# EAGLE design HMS_Olfactometer_v2.1 (EAGLE 9.1.1)

## Sheet 1 of 2
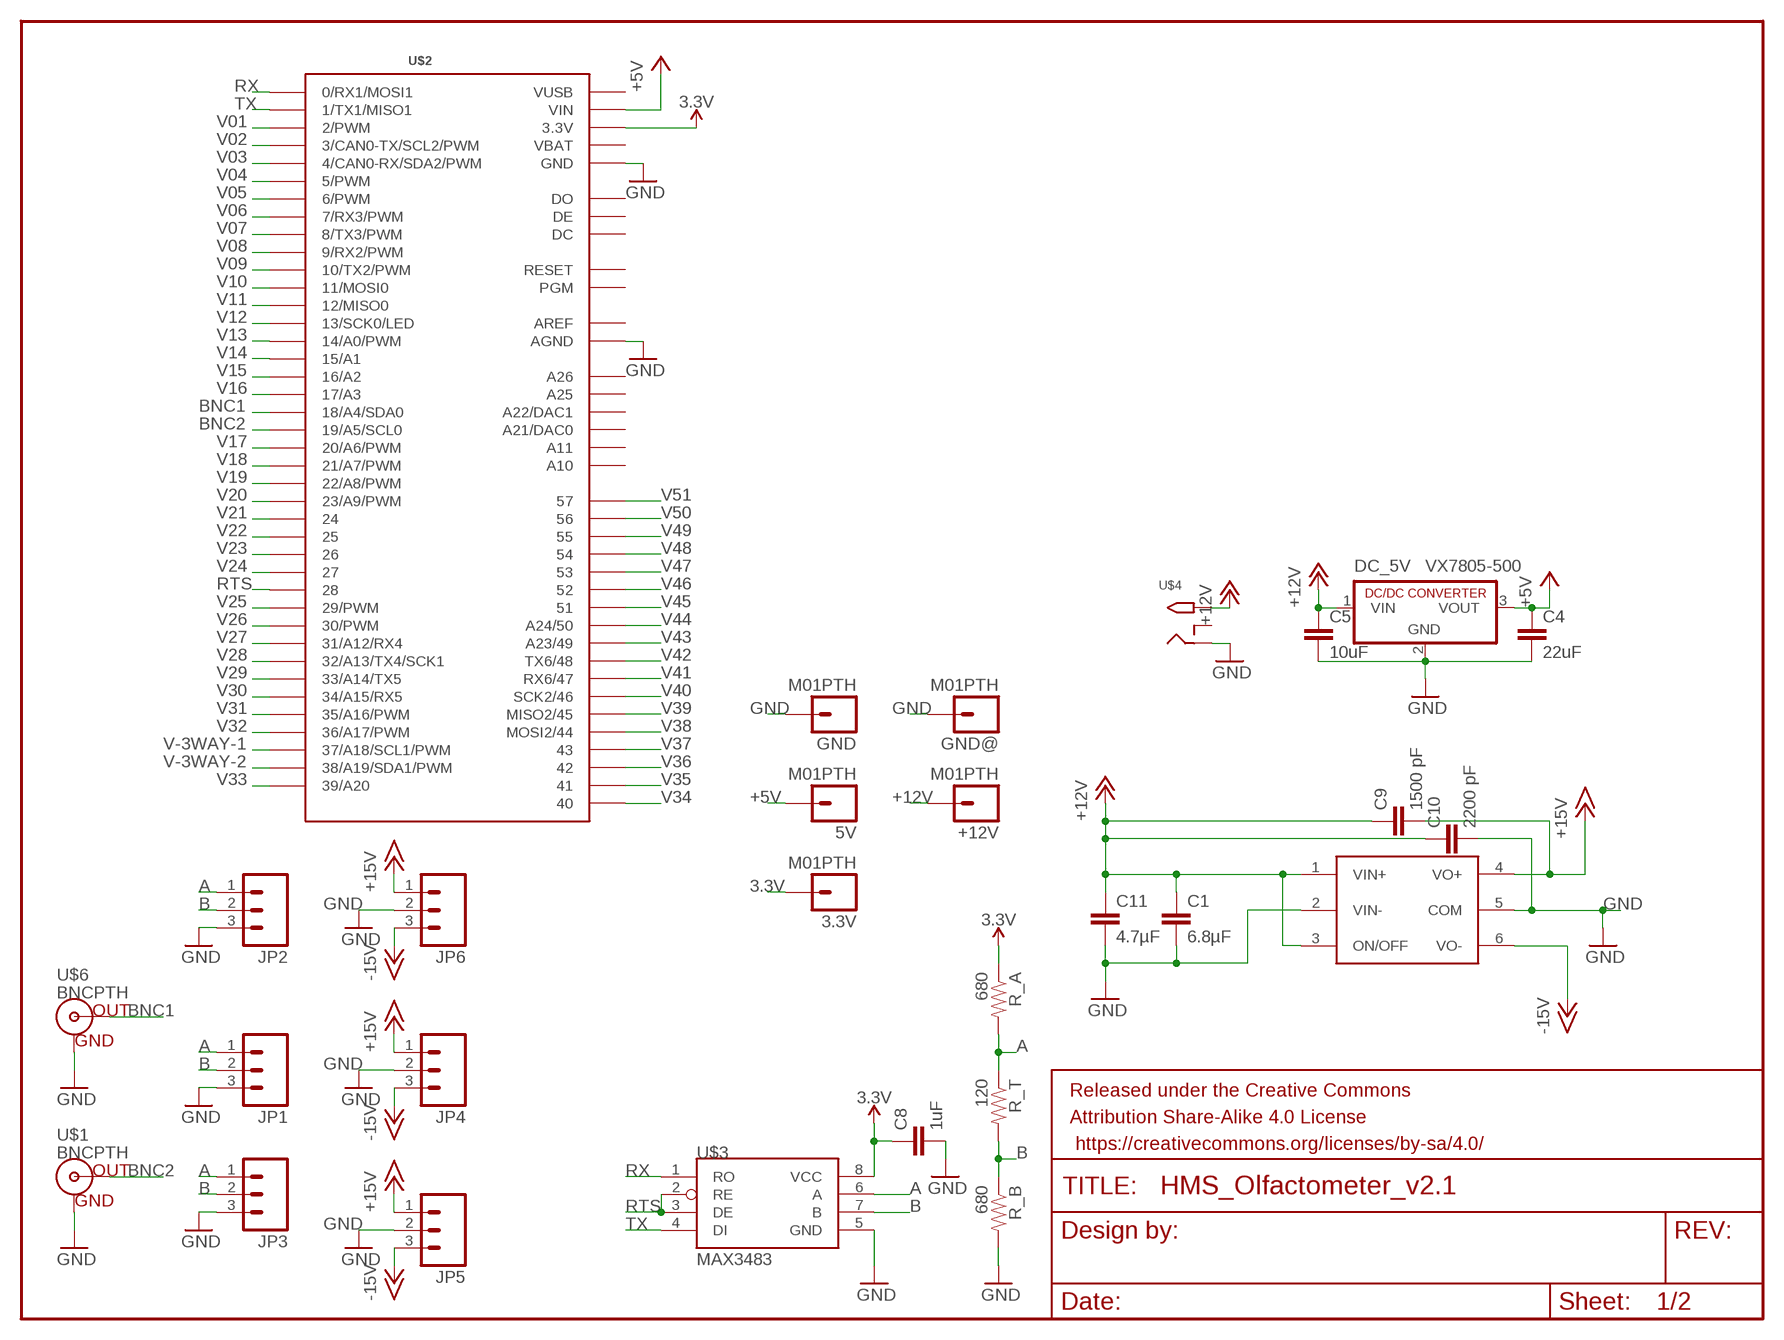
[diagram p0: schematic, sheet 1]

### Parts
3.3V  M01PTH  [1X01]
5V  M01PTH  [1X01]
+12V  M01PTH  [1X01]
C1  6.8µF  C-EUC1812  [C1812]
C4  22uF  10UF-6.3V-20%(1206)  [1206]
C5  10uF  CAP1206  [1206]
C8  1uF  CAP1206  [1206]
C9  1500 pF  C-EUC1206  [C1206]
C10  2200 pF  C-EUC1206  [C1206]
C11  4.7µF  C-EUC1812  [C1812]
DC_5V  VX7805-500  R-78C12-1.0  [SIP3]
DC_+/-15V  XPPOWER_+/-15V_60W_DC-DC_SUPPLY  [XPPOWER_60W_JTL60_DC_DC_POWER_SUPPLY]
FRAME1  FRAME-LETTER  [CREATIVE_COMMONS]
GND  M01PTH  [1X01]
GND@  M01PTH  [1X01]
JP1  M03POLAR  [MOLEX-1X3]
JP2  M03POLAR  [MOLEX-1X3]
JP3  M03POLAR  [MOLEX-1X3]
JP4  M03SCREW  [SCREWTERMINAL-3.5MM-3]
JP5  M03SCREW  [SCREWTERMINAL-3.5MM-3]
JP6  M03SCREW  [SCREWTERMINAL-3.5MM-3]
R_A  680  RESISTORPTH-1/2W  [AXIAL-0.5]
R_B  680  RESISTORPTH-1/2W  [AXIAL-0.5]
R_T  120  RESISTORPTH-1/2W  [AXIAL-0.5]
U$1  BNCPTH  [BNC]
U$2  TEENSY_3.5_ALL_PINS&PADS  [TEENSY_3.5_ALL_PINS&PADS]
U$3  MAX3483  MAX485DIL  [DIL08]
U$4  2.1MMJACKTHM  [PJ-102A]
U$6  BNCPTH  [BNC]

### Nets
3.3V [power]: 3.3V.1 C8.1 R_A.P$1 U$2.3.3V U$2.3.3V2(3.3V) U$2.3.3V3(3.3V) U$2.3.3V4(3.3V) U$3.8(VCC)
+5V [power]: 5V.1 C4.1 DC_5V.3(VOUT) U$2.VIN
+12V [power]: +12V.1 C1.1 C5.1 C9.1 C10.1 C11.1 DC_5V.1(VIN) DC_+/-15V.1(VIN+) DC_+/-15V.3(ON/OFF) U$4.TIP ; also sheet 2
+15V: C9.2 DC_+/-15V.4(VO+) JP4.1 JP5.1 JP6.1
-15V: DC_+/-15V.6(VO-) JP4.3 JP5.3 JP6.3
A: JP1.1 JP2.1 JP3.1 R_A.P$2 R_T.P$1 U$3.6(A)
B: JP1.2 JP2.2 JP3.2 R_B.P$1 R_T.P$2 U$3.7(B)
BNC1: U$2.18/A4(18/A4/SDA0) U$6.S(OUT)
BNC2: U$1.S(OUT) U$2.19/A5(19/A5/SCL0)
GND: C1.2 C4.2 C5.2 C8.2 C10.2 C11.2 DC_5V.2(GND) DC_+/-15V.2(VIN-) DC_+/-15V.5(COM) GND.1 GND@.1 JP1.3 JP2.3 JP3.3 JP4.2 JP5.2 JP6.2 R_B.P$2 U$1.GND U$2.AGND U$2.GND U$2.GND1(GND) U$2.GND2(GND) U$2.GND3(GND) U$2.GND4(GND) U$2.GND5(GND) U$2.GND6(GND) U$3.5(GND) U$4.RING U$6.GND ; also sheet 2
RTS: U$2.28 U$3.2(RE) U$3.3(DE)
RX: U$2.0(0/RX1/MOSI1) U$3.1(RO)
TX: U$2.1(1/TX1/MISO1) U$3.4(DI)
V01: U$2.2(2/PWM) ; also sheet 2
V02: U$2.3(3/CAN0-TX/SCL2/PWM) ; also sheet 2
V03: U$2.4(4/CAN0-RX/SDA2/PWM) ; also sheet 2
V04: U$2.5(5/PWM) ; also sheet 2
V05: U$2.6(6/PWM) ; also sheet 2
V06: U$2.7(7/RX3/PWM) ; also sheet 2
V07: U$2.8(8/TX3/PWM) ; also sheet 2
V08: U$2.9(9/RX2/PWM) ; also sheet 2
V09: U$2.10(10/TX2/PWM) ; also sheet 2
V10: U$2.11(11/MOSI0) ; also sheet 2
V11: U$2.12(12/MISO0) ; also sheet 2
V12: U$2.13(13/SCK0/LED) ; also sheet 2
V13: U$2.14/A0(14/A0/PWM) ; also sheet 2
V14: U$2.15/A1 ; also sheet 2
V15: U$2.16/A2 ; also sheet 2
V16: U$2.17/A3 ; also sheet 2
V17: U$2.20/A6(20/A6/PWM) ; also sheet 2
V18: U$2.21/A7(21/A7/PWM) ; also sheet 2
V19: U$2.22/A8(22/A8/PWM) ; also sheet 2
V20: U$2.23/A9(23/A9/PWM) ; also sheet 2
V21: U$2.24 ; also sheet 2
V22: U$2.25 ; also sheet 2
V23: U$2.26 ; also sheet 2
V24: U$2.27 ; also sheet 2
V25: U$2.29(29/PWM) ; also sheet 2
V26: U$2.30(30/PWM) ; also sheet 2
V27: U$2.31/A12(31/A12/RX4) ; also sheet 2
V28: U$2.32/A13(32/A13/TX4/SCK1) ; also sheet 2
V29: U$2.33/A14(33/A14/TX5) ; also sheet 2
V30: U$2.34/A15(34/A15/RX5) ; also sheet 2
V31: U$2.35/A16(35/A16/PWM) ; also sheet 2
V32: U$2.36/A17(36/A17/PWM) ; also sheet 2
V33: U$2.39/A20 ; also sheet 2
V34: U$2.40 ; also sheet 2
V35: U$2.41 ; also sheet 2
V36: U$2.42 ; also sheet 2
V37: U$2.43 ; also sheet 2
V38: U$2.44(MOSI2/44) ; also sheet 2
V39: U$2.45(MISO2/45) ; also sheet 2
V40: U$2.46(SCK2/46) ; also sheet 2
V41: U$2.47(RX6/47) ; also sheet 2
V42: U$2.48(TX6/48) ; also sheet 2
V43: U$2.49(A23/49) ; also sheet 2
V44: U$2.50(A24/50) ; also sheet 2
V45: U$2.51 ; also sheet 2
V46: U$2.52 ; also sheet 2
V47: U$2.53 ; also sheet 2
V48: U$2.54 ; also sheet 2
V49: U$2.55 ; also sheet 2
V50: U$2.56 ; also sheet 2
V51: U$2.57 ; also sheet 2
V-3WAY-1: U$2.37/A18(37/A18/SCL1/PWM) ; also sheet 2
V-3WAY-2: U$2.38/A19(38/A19/SDA1/PWM) ; also sheet 2
Unconnected: U$2.A10 U$2.A11 U$2.A21(A21/DAC0) U$2.A22(A22/DAC1) U$2.A25 U$2.A26 U$2.DC U$2.DE U$2.DO U$2.PGM U$2.RESET U$4.RING_SW

## Sheet 2 of 2
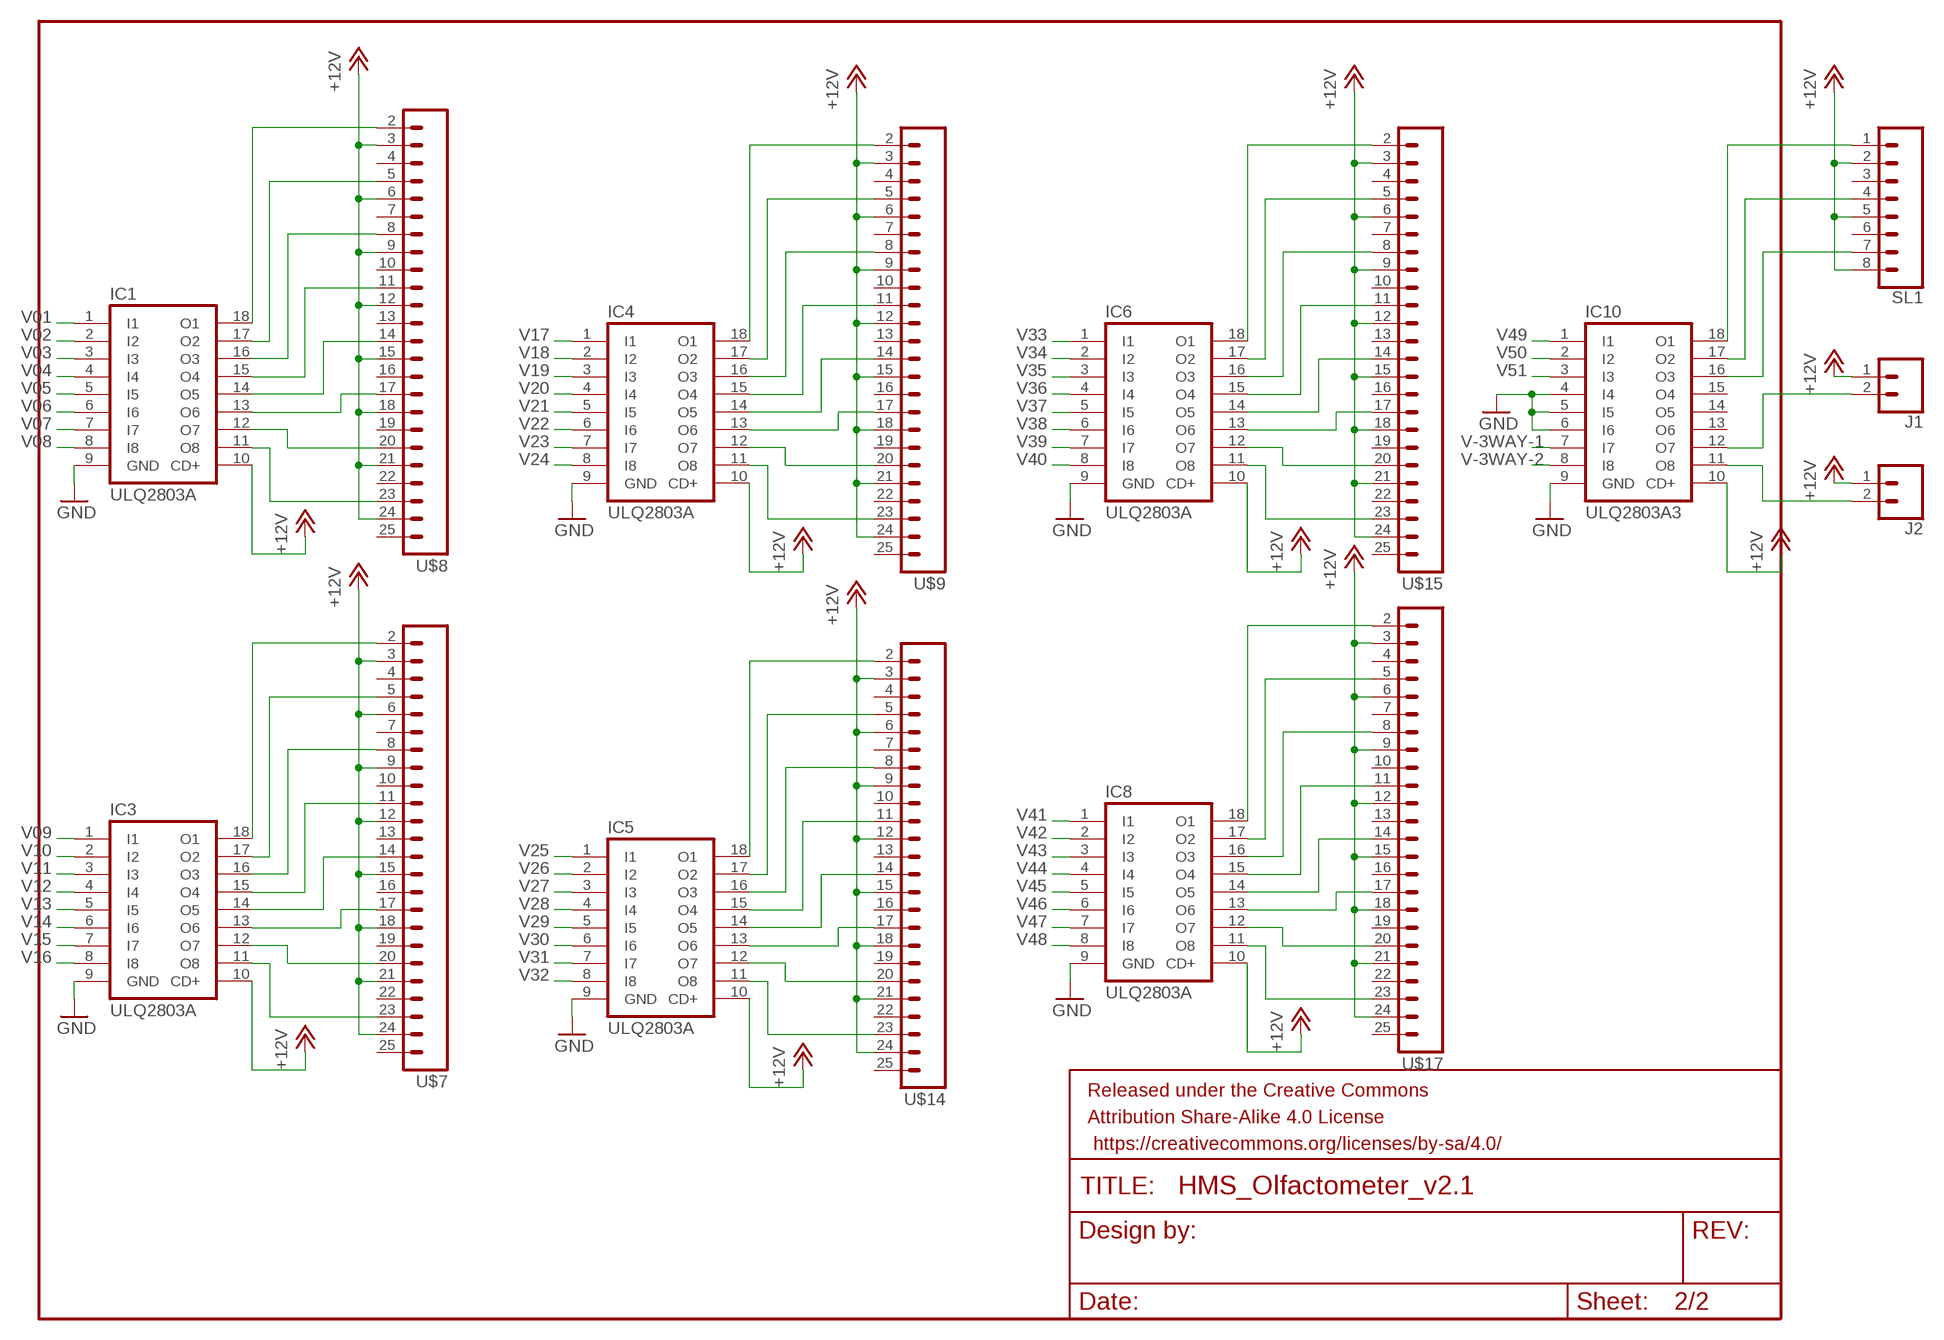
[diagram p1: schematic, sheet 2]

### Parts
FRAME2  FRAME-LETTER  [CREATIVE_COMMONS]
IC1  ULQ2803A  ULN2803A  [DIL18]
IC3  ULQ2803A  ULN2803A  [DIL18]
IC4  ULQ2803A  ULN2803A  [DIL18]
IC5  ULQ2803A  ULN2803A  [DIL18]
IC6  ULQ2803A  ULN2803A  [DIL18]
IC8  ULQ2803A  ULN2803A  [DIL18]
IC10  ULQ2803A3  ULN2803A  [DIL18]
J1  CONN_02  [1X02]
J2  CONN_02  [1X02]
SL1  CONN_08"  [1X08]
U$7  M24  [1X24]
U$8  M24  [1X24]
U$9  M24  [1X24]
U$14  M24  [1X24]
U$15  M24  [1X24]
U$17  M24  [1X24]

### Nets
+12V [power]: IC1.10(CD+) IC3.10(CD+) IC4.10(CD+) IC5.10(CD+) IC6.10(CD+) IC8.10(CD+) IC10.10(CD+) J1.1 J2.1 SL1.2 SL1.5 SL1.8 U$7.3 U$7.6 U$7.9 U$7.12 U$7.15 U$7.18 U$7.21 U$7.24 U$8.3 U$8.6 U$8.9 U$8.12 U$8.15 U$8.18 U$8.21 U$8.24 U$9.3 U$9.6 U$9.9 U$9.12 U$9.15 U$9.18 U$9.21 U$9.24 U$14.3 U$14.6 U$14.9 U$14.12 U$14.15 U$14.18 U$14.21 U$14.24 U$15.3 U$15.6 U$15.9 U$15.12 U$15.15 U$15.18 U$15.21 U$15.24 U$17.3 U$17.6 U$17.9 U$17.12 U$17.15 U$17.18 U$17.21 U$17.24 ; also sheet 1
GND: IC1.9(GND) IC3.9(GND) IC4.9(GND) IC5.9(GND) IC6.9(GND) IC8.9(GND) IC10.4(I4) IC10.5(I5) IC10.6(I6) IC10.9(GND) ; also sheet 1
N$2: IC1.18(O1) U$8.2
N$3: IC1.17(O2) U$8.5
N$4: IC1.16(O3) U$8.8
N$5: IC1.15(O4) U$8.11
N$6: IC1.14(O5) U$8.14
N$7: IC1.13(O6) U$8.17
N$8: IC1.12(O7) U$8.20
N$9: IC1.11(O8) U$8.23
N$17: IC3.11(O8) U$7.23
N$18: IC3.12(O7) U$7.20
N$19: IC3.13(O6) U$7.17
N$20: IC3.14(O5) U$7.14
N$21: IC3.15(O4) U$7.11
N$22: IC3.16(O3) U$7.8
N$23: IC3.17(O2) U$7.5
N$24: IC3.18(O1) U$7.2
N$25: IC4.11(O8) U$9.23
N$26: IC4.12(O7) U$9.20
N$27: IC4.13(O6) U$9.17
N$28: IC4.14(O5) U$9.14
N$29: IC4.15(O4) U$9.11
N$30: IC4.16(O3) U$9.8
N$31: IC4.17(O2) U$9.5
N$32: IC4.18(O1) U$9.2
N$33: IC5.11(O8) U$14.23
N$34: IC5.12(O7) U$14.20
N$35: IC5.13(O6) U$14.17
N$36: IC5.14(O5) U$14.14
N$37: IC5.15(O4) U$14.11
N$38: IC5.16(O3) U$14.8
N$39: IC5.17(O2) U$14.5
N$40: IC5.18(O1) U$14.2
N$51: IC6.11(O8) U$15.23
N$52: IC6.12(O7) U$15.20
N$61: IC6.13(O6) U$15.17
N$63: IC6.14(O5) U$15.14
N$64: IC6.15(O4) U$15.11
N$65: IC6.16(O3) U$15.8
N$66: IC6.17(O2) U$15.5
N$67: IC6.18(O1) U$15.2
N$76: IC8.11(O8) U$17.23
N$77: IC8.12(O7) U$17.20
N$78: IC8.13(O6) U$17.17
N$79: IC8.14(O5) U$17.14
N$80: IC8.15(O4) U$17.11
N$81: IC8.16(O3) U$17.8
N$82: IC8.17(O2) U$17.5
N$83: IC8.18(O1) U$17.2
N$92: IC10.11(O8) J2.2
N$93: IC10.12(O7) J1.2
N$97: IC10.16(O3) SL1.7
N$98: IC10.17(O2) SL1.4
N$99: IC10.18(O1) SL1.1
V01: IC1.1(I1) ; also sheet 1
V02: IC1.2(I2) ; also sheet 1
V03: IC1.3(I3) ; also sheet 1
V04: IC1.4(I4) ; also sheet 1
V05: IC1.5(I5) ; also sheet 1
V06: IC1.6(I6) ; also sheet 1
V07: IC1.7(I7) ; also sheet 1
V08: IC1.8(I8) ; also sheet 1
V09: IC3.1(I1) ; also sheet 1
V10: IC3.2(I2) ; also sheet 1
V11: IC3.3(I3) ; also sheet 1
V12: IC3.4(I4) ; also sheet 1
V13: IC3.5(I5) ; also sheet 1
V14: IC3.6(I6) ; also sheet 1
V15: IC3.7(I7) ; also sheet 1
V16: IC3.8(I8) ; also sheet 1
V17: IC4.1(I1) ; also sheet 1
V18: IC4.2(I2) ; also sheet 1
V19: IC4.3(I3) ; also sheet 1
V20: IC4.4(I4) ; also sheet 1
V21: IC4.5(I5) ; also sheet 1
V22: IC4.6(I6) ; also sheet 1
V23: IC4.7(I7) ; also sheet 1
V24: IC4.8(I8) ; also sheet 1
V25: IC5.1(I1) ; also sheet 1
V26: IC5.2(I2) ; also sheet 1
V27: IC5.3(I3) ; also sheet 1
V28: IC5.4(I4) ; also sheet 1
V29: IC5.5(I5) ; also sheet 1
V30: IC5.6(I6) ; also sheet 1
V31: IC5.7(I7) ; also sheet 1
V32: IC5.8(I8) ; also sheet 1
V33: IC6.1(I1) ; also sheet 1
V34: IC6.2(I2) ; also sheet 1
V35: IC6.3(I3) ; also sheet 1
V36: IC6.4(I4) ; also sheet 1
V37: IC6.5(I5) ; also sheet 1
V38: IC6.6(I6) ; also sheet 1
V39: IC6.7(I7) ; also sheet 1
V40: IC6.8(I8) ; also sheet 1
V41: IC8.1(I1) ; also sheet 1
V42: IC8.2(I2) ; also sheet 1
V43: IC8.3(I3) ; also sheet 1
V44: IC8.4(I4) ; also sheet 1
V45: IC8.5(I5) ; also sheet 1
V46: IC8.6(I6) ; also sheet 1
V47: IC8.7(I7) ; also sheet 1
V48: IC8.8(I8) ; also sheet 1
V49: IC10.1(I1) ; also sheet 1
V50: IC10.2(I2) ; also sheet 1
V51: IC10.3(I3) ; also sheet 1
V-3WAY-1: IC10.7(I7) ; also sheet 1
V-3WAY-2: IC10.8(I8) ; also sheet 1
Unconnected: IC10.13(O6) IC10.14(O5) IC10.15(O4) SL1.3 SL1.6 U$7.4 U$7.7 U$7.10 U$7.13 U$7.16 U$7.19 U$7.22 U$7.25 U$8.4 U$8.7 U$8.10 U$8.13 U$8.16 U$8.19 U$8.22 U$8.25 U$9.4 U$9.7 U$9.10 U$9.13 U$9.16 U$9.19 U$9.22 U$9.25 U$14.4 U$14.7 U$14.10 U$14.13 U$14.16 U$14.19 U$14.22 U$14.25 U$15.4 U$15.7 U$15.10 U$15.13 U$15.16 U$15.19 U$15.22 U$15.25 U$17.4 U$17.7 U$17.10 U$17.13 U$17.16 U$17.19 U$17.22 U$17.25

## Power pins joined to a net without a drawn wire
AREF: U$2.AREF
VBAT: U$2.VBAT
VUSB: U$2.VUSB

## Library data of the parts
3.3V 5V +12V GND GND@ = SparkFun-Connectors:M01: Header 1 Standard 1-pin 0.1" header. Use with straight break away headers (SKU : PRT-00116), right angle break away headers (PRT-00553), swiss pins (PRT-00743), machine pins (PRT-00117), and female headers (PRT-00115).
C1 C9-C11 = rcl:C-EU: CAPACITOR, European symbol; SPICEPREFIX: C
C4 = SparkFun-Capacitors:10UF-6.3V-20%(1206): Ceramic CAP-10057; PROD_ID: CAP-10057; VALUE: 10uF
C5 C8 = SparkFun-Capacitors:CAP: Capacitor Standard 0603 ceramic capacitor, and 0.1" leaded capacitor.
DC_5V = dc-dc-converter:R-78C*-1.0: INNOLINE DC/DC-Converter 1.0 AMP SIP3 Single Output Source: Data sheet <http://www.mikrocontroller.net/attachment/150645/157764-da-01-en-DC_DC_WANDLER_R_78C5_0_1_0.pdf>
DC_+/-15V = ofer-eagle-lib:XPPOWER_+/-15V_60W_DC-DC_SUPPLY
FRAME1 FRAME2 = SparkFun-Aesthetics:FRAME-LETTER: Schematic Frame - Letter Standard 8.5x11 US Letter frame
IC1 IC3-IC6 IC8 IC10 = uln-udn:ULN2803A: DRIVER ARRAY
J1 J2 = SparkFun-Connectors:CONN_02: Multi connection point. Often used as Generic Header-pin footprint for 0.1 inch spaced/style header connections On any of the 0.1 inch spaced packages, you can populate with these: Break Away Headers - Straight <https://www.sparkfun.com/products/116> (PRT-00116) Break Away Male Headers - Right Angle <https://www.sparkfun.com/products/553> (PRT-00553) Female Headers <https://www.sparkfun.com/products/115> (PRT-00115) Break Away Headers - Machine Pin <https://www.sparkfun.com/products/117> (PRT-00117) Break Away Female Headers - Swiss Machine Pin <https://www.sparkfun.com/products/743> (PRT-00743) For SCREWTERMINALS and SPRING TERMINALS visit here: Screw Terimnals on SparkFun.com <https://www.sparkfun.com/search/results?term=Screw+Terminals> (5mm/3.5mm/2.54mm spacing) This device is also useful as a general connection point to wire up your design to another part of your project. Our various solder wires solder well into these plated through hole pads. Hook-Up Wire - Assortment (Stranded, 22 AWG) <https://www.sparkfun.com/products/11375> (PRT-11375) Hook-Up Wire - Assortment (Solid Core, 22 AWG) <https://www.sparkfun.com/products/11367> (PRT-11367) View the entire wire category on our website here <https://www.sparkfun.com/categories/141> Special notes: Molex polarized connector foot print use with: PRT-08233 with associated crimp pins and housings. 2.54_SCREWTERM for use with PRT-10571. 3.5mm Screw Terminal footprints for PRT-08084 5mm Screw Terminal footprints for use with PRT-08432
JP1-JP6 = SparkFun-Connectors:M03: Header 3 Standard 3-pin 0.1" header. Use with straight break away headers (SKU : PRT-00116), right angle break away headers (PRT-00553), swiss pins (PRT-00743), machine pins (PRT-00117), and female headers (PRT-00115). Molex polarized connector foot print use with SKU : PRT-08232 with associated crimp pins and housings.
R_A R_B R_T = SparkFun-Resistors:RESISTOR: Resistor Basic schematic elements and footprints for 0603, 1206, and PTH resistors.
SL1 = SparkFun-Connectors:CONN_08: Multi connection point. Often used as Generic Header-pin footprint for 0.1 inch spaced/style header connections On any of the 0.1 inch spaced packages, you can populate with these: Break Away Headers - Straight <https://www.sparkfun.com/products/116> (PRT-00116) Break Away Male Headers - Right Angle <https://www.sparkfun.com/products/553> (PRT-00553) Female Headers <https://www.sparkfun.com/products/115> (PRT-00115) Break Away Headers - Machine Pin <https://www.sparkfun.com/products/117> (PRT-00117) Break Away Female Headers - Swiss Machine Pin <https://www.sparkfun.com/products/743> (PRT-00743) Arduino Stackable Header - 8 Pin <https://www.sparkfun.com/products/9279> (PRT-09279) For SCREWTERMINALS and SPRING TERMINALS visit here: Screw Terimnals on SparkFun.com <https://www.sparkfun.com/search/results?term=Screw+Terminals> (5mm/3.5mm/2.54mm spacing) This device is also useful as a general connection point to wire up your design to another part of your project. Our various solder wires solder well into these plated through hole pads. Hook-Up Wire - Assortment (Stranded, 22 AWG) <https://www.sparkfun.com/products/11375> (PRT-11375) Hook-Up Wire - Assortment (Solid Core, 22 AWG) <https://www.sparkfun.com/products/11367> (PRT-11367) View the entire wire category on our website here <https://www.sparkfun.com/categories/141> Special notes: Molex polarized connector foot print use with SKU : PRT-08231 with associated crimp pins and housings. 1MM SMD Version SKU: PRT-10208 NOTES ON THE VARIANTS LOCK and LOCK_LONGPADS... This footprint was designed to help hold the alignment of a through-hole component (i.e. 6-pin header) while soldering it into place. You may notice that each hole has been shifted either up or down by 0.005 of an inch from it's more standard position (which is a perfectly straight line). This slight alteration caused the pins (the squares in the middle) to touch the edges of the holes. Because they are alternating, it causes a "brace" to hold the component in place. 0.005 has proven to be the perfect amount of "off-center" position when using our standard breakaway headers. Although looks a little odd when you look at the bare footprint, once you have a header in there, the alteration is very hard to notice. Also,if you push a header all the way into place, it is covered up entirely on the bottom side.; PROD_ID: CONN-08438
U$1 U$6 = SparkFun-Connectors:BNC: BNC Connector, Mouser Part# 5227161
U$2 = Teensy_3_and_LC_Series_Boards_v1.4:TEENSY_3.5_ALL_PINS&PADS: All pins and pads on the Teensy 3.5 exposed. Assumes the use of multiple, unshrouded headers to get access to the pads on the underside of the Teensy These headers should be a 2x5, 2x4, and a 2x3 with a 0.1" hole spacing / pitch.
U$3 = SparkFun-DigitalIC:MAX485: RS-485 transceiver; SPICEPREFIX: X
U$4 = adafruit:2.1MMJACK: 2.1mm x 5.5mm THM DC jack with internal switch. Digikey part #PJ-102A, 4UCON part #05537 2.1mm x 5.5mm SMT DC jack with internal switch. Digikey part #PJ-002A-SMT, 4UCON part #03267 By microbuilder.eu & adafruit.com
U$7-U$9 U$14 U$15 U$17 = SparkFun-Connectors:M24: 1x24 .1" header

## Net classes
0 default: width 0.203 mm, clearance 0.203 mm
1 power: width 0.61 mm, clearance 0.254 mm

## Board
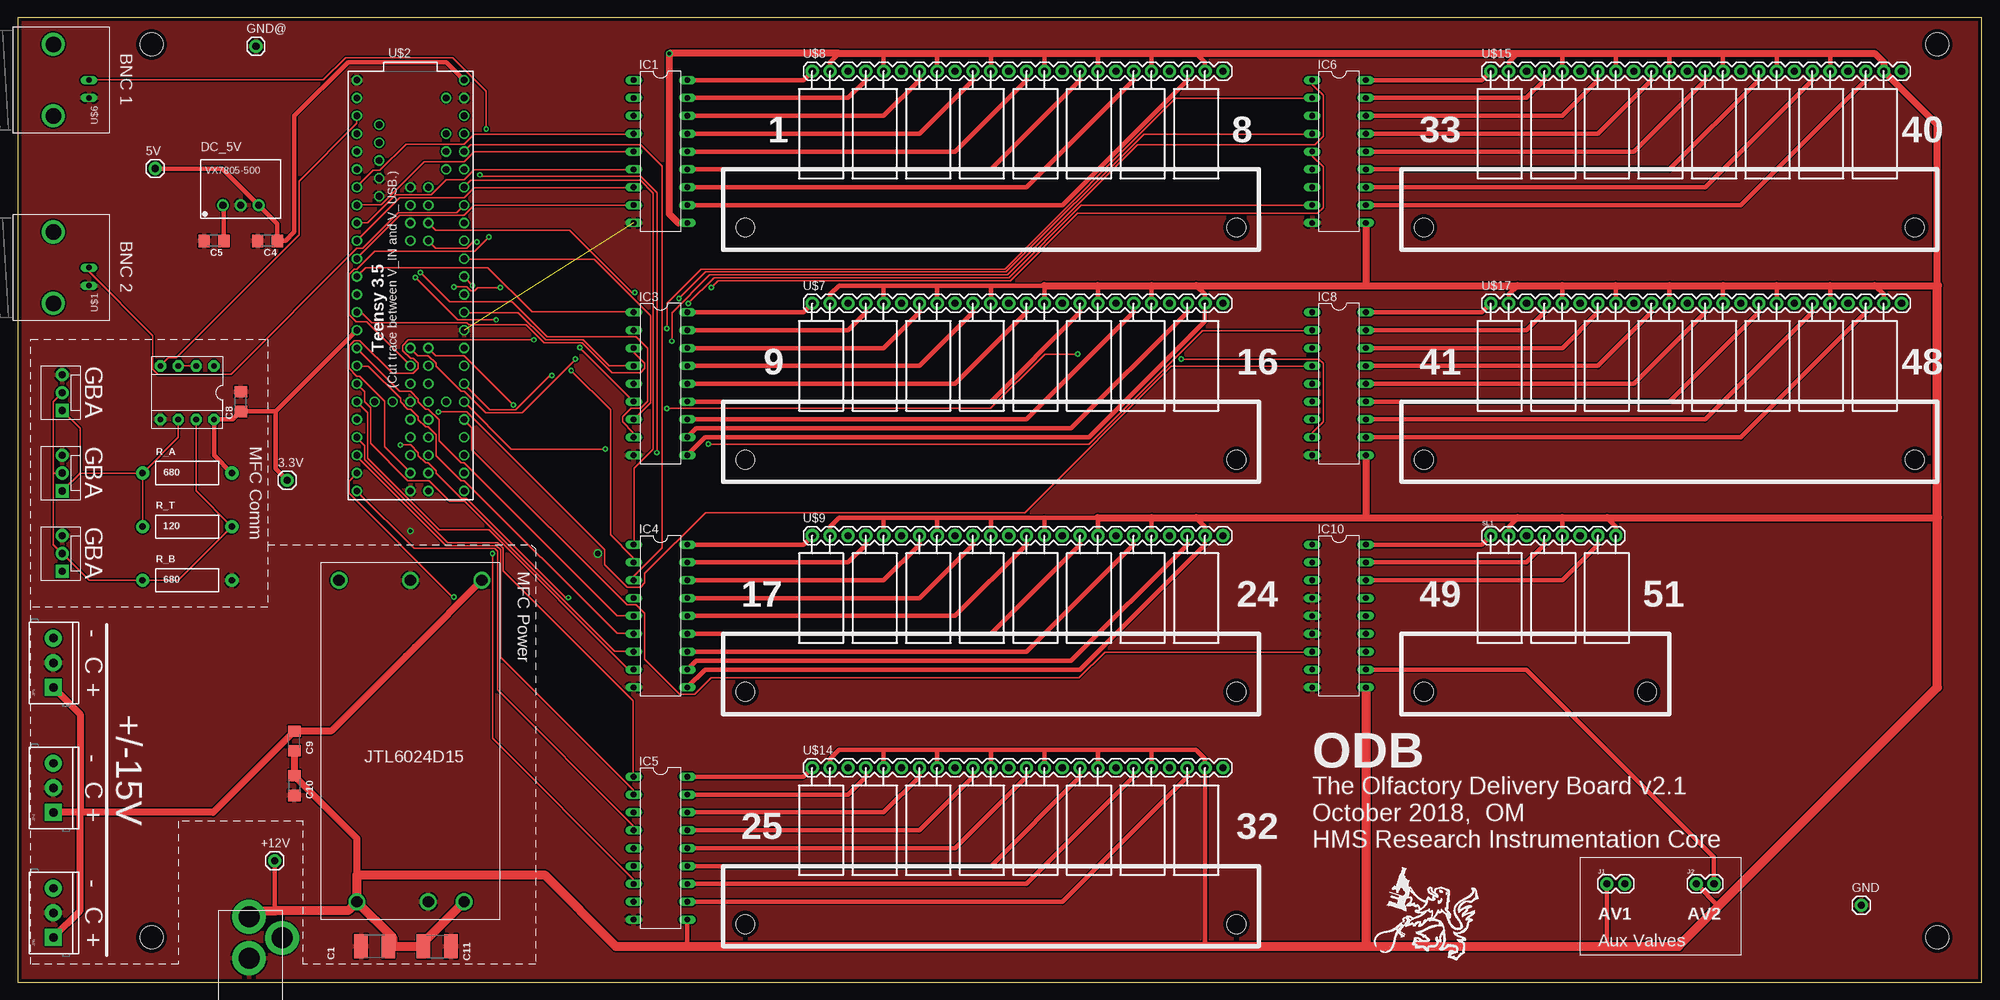
[diagram p2: board, top side]
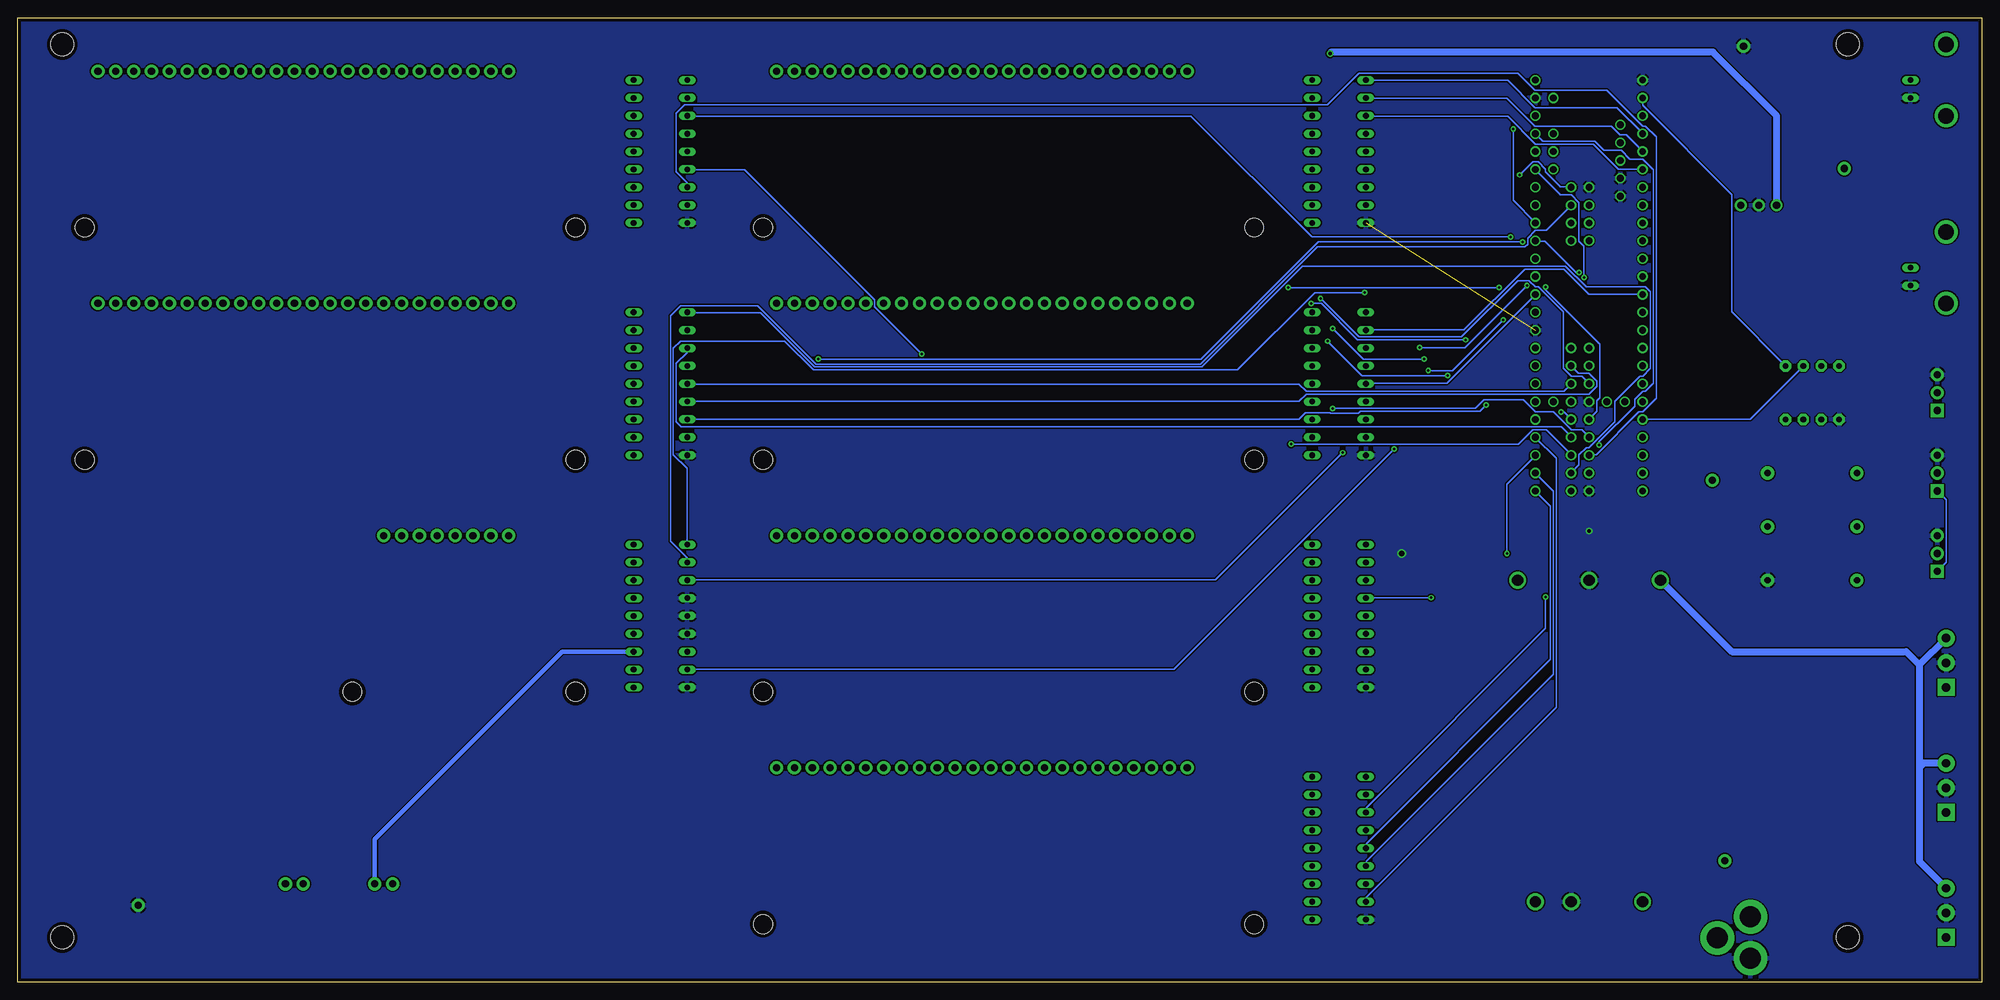
[diagram p3: board, bottom side, seen from below]

Size 279.4 x 137.16 mm. Coordinates in mm from the lower left corner, seen from the top.
Outline: 0,0 279.4,0 279.4,137.16 0,137.16 0,0
Copper layers (1*16): Top 0.0178mm / dielectric 59mil / Bottom 0.0178mm
Design rules "SSC-EAGLE-2Lyr_v1.0.0.3 *": minimum track width 6mil, minimum drill 14mil, track to track 6mil, track to pad 6mil, pad to pad 6mil, via to via 6mil, smd to smd 6mil, copper to edge 20mil, drill to drill 16mil, minimum pad ring 8mil, minimum via ring 8mil, stop-mask expansion 3mil, vias tented up to drill 0mil, thermal gap 10mil
Holes 2.72 mm at 173.35,107.31 103.5,107.31 173.35,74.3 103.5,74.3 173.35,41.27 103.5,41.27 173.35,8.26 103.5,8.26 269.88,107.31 200.03,107.31 269.88,74.3 200.03,74.3 231.78,41.27 200.03,41.27

### Footprints (pad centres in the part's own frame; a part is rotated, then mirrored left to right if it is on the bottom)
1X01 = drill 1.016 pad 1.88: 1 0,0
C1812 = smd 1.9 x 3.4: 1 -1.95,0; 2 1.95,0
1206 = smd 1.6 x 1.8: 1 -1.4,0; 2 1.4,0
C1206 = smd 1.6 x 1.8: 1 -1.4,0; 2 1.4,0
SIP3 = drill 1 pad 1.676: 1 -2.54,0; 2 0,0; 3 2.54,0
XPPOWER_60W_JTL60_DC_DC_POWER_SUPPLY = drill 1.6: 1 -22.86,-7.62; 2 -22.86,-2.54; 3 -22.86,7.62; 4 22.86,-10.16; 5 22.86,0; 6 22.86,10.16
DIL18 = drill 0.813 long: 1 -10.16,-3.81; 2 -7.62,-3.81; 3 -5.08,-3.81; 4 -2.54,-3.81; 5 0,-3.81; 6 2.54,-3.81; 7 5.08,-3.81; 8 7.62,-3.81; 9 10.16,-3.81; 10 10.16,3.81; 11 7.62,3.81; 12 5.08,3.81; 13 2.54,3.81; 14 0,3.81; 15 -2.54,3.81; 16 -5.08,3.81; 17 -7.62,3.81; 18 -10.16,3.81
1X02 = drill 1.016 pad 1.88: 1 0,0; 2 2.54,0
MOLEX-1X3 = drill 1.016 pad 1.88 square: 1 0,0 | drill 1.016 pad 1.88: 2 2.54,0; 3 5.08,0
SCREWTERMINAL-3.5MM-3 = drill 1.2 pad 2.413 square: 1 0,0 | drill 1.2 pad 2.413: 2 3.5,0; 3 7,0
AXIAL-0.5 = drill 0.9 pad 1.88: P$1 -6.35,0; P$2 6.35,0
1X08 = drill 1.016 pad 1.88: 1 0,0; 2 2.54,0; 3 5.08,0; 4 7.62,0; 5 10.16,0; 6 12.7,0; 7 15.24,0; 8 17.78,0
BNC = drill 2.2: 3 -5.08,5.08; 4 5.08,5.08 | drill 0.8 long: GND -2.54,0; S 0,0
TEENSY_3.5_ALL_PINS&PADS = drill 0.965: 0 -7.62,13.97; 1 -7.62,11.43; 2 -7.62,8.89; 3 -7.62,6.35; 3.3V 7.62,11.43; 3.3V2 2.54,-41.91; 3.3V3 -7.62,-19.05; 3.3V4 -2.54,-29.21; 4 -7.62,3.81; 5 -7.62,1.27; 6 -7.62,-1.27; 7 -7.62,-3.81; 8 -7.62,-6.35; 9 -7.62,-8.89; 10 -7.62,-11.43; 11 -7.62,-13.97; 12 -7.62,-16.51; 13 7.62,-16.51; 14/A0 7.62,-13.97; 15/A1 7.62,-11.43; 16/A2 7.62,-8.89; 17/A3 7.62,-6.35; 18/A4 7.62,-3.81; 19/A5 7.62,-1.27; 20/A6 7.62,1.27; 21/A7 7.62,3.81; 22/A8 7.62,6.35; 23/A9 7.62,8.89; 24 -7.62,-21.59; 25 -7.62,-24.13; 26 -7.62,-26.67; 27 -7.62,-29.21; 28 -7.62,-31.75; 29 -7.62,-34.29; 30 -7.62,-36.83; 31/A12 -7.62,-39.37; 32/A13 -7.62,-41.91; 33/A14 7.62,-41.91; 34/A15 7.62,-39.37; 35/A16 7.62,-36.83; 36/A17 7.62,-34.29; 37/A18 7.62,-31.75; 38/A19 7.62,-29.21; 39/A20 7.62,-26.67; 40 0,-21.59; 41 0,-24.13; 42 0,-26.67; 43 0,-31.75; 44 0,-34.29; 45 0,-36.83; 46 0,-39.37; 47 2.54,-39.37; 48 2.54,-36.83; 49 2.54,-34.29; 50 2.54,-31.75; 51 2.54,-26.67; 52 2.54,-24.13; 53 2.54,-21.59; 54 2.54,-6.35; 55 2.54,-3.81; 56 2.54,-1.27; 57 2.54,1.27; A10 5.08,6.35; A11 5.08,3.81; A21 7.62,-24.13; A22 7.62,-21.59; A25 -4.445,5.08; A26 -4.445,7.62; AGND 7.62,13.97; AREF 5.08,8.89; DC 0,-3.81; DE 0,-1.27; DO 0,-6.35; GND -7.62,16.51; GND1 7.62,-19.05; GND2 0,1.27; GND3 -4.445,2.54; GND4 -4.445,0; GND5 0,-41.91; GND6 0,-29.21; NC -4.445,10.16; PGM 2.54,-29.21; RESET 5.08,-29.21; VBAT -5.08,-29.21; VIN 7.62,16.51; VUSB 5.08,13.97
DIL08 = drill 0.813 pad 1.6 octagon: 1 -3.81,-3.81; 2 -1.27,-3.81; 3 1.27,-3.81; 4 3.81,-3.81; 5 3.81,3.81; 6 1.27,3.81; 7 -1.27,3.81; 8 -3.81,3.81
PJ-102A = drill 3 pad 4.8: RING 0.1,-3.39; RING_SW -4.6,-6.29; TIP 0.1,-9.29
1X24 = drill 1.016 pad 1.88: 2 -26.67,0; 3 -24.13,0; 4 -21.59,0; 5 -19.05,0; 6 -16.51,0; 7 -13.97,0; 8 -11.43,0; 9 -8.89,0; 10 -6.35,0; 11 -3.81,0; 12 -1.27,0; 13 1.27,0; 14 3.81,0; 15 6.35,0; 16 8.89,0; 17 11.43,0; 18 13.97,0; 19 16.51,0; 20 19.05,0; 21 21.59,0; 22 24.13,0; 23 26.67,0; 24 29.21,0; 25 31.75,0
STAND-OFF = hole 3.302: 0,0

### Placement (x,y rotation side)
3.3V  38.35,71.37 0 top
5V  19.56,115.7 0 top
+12V  36.58,17.27 0 top
C1  50.8,5.08 180 top
C4  35.56,105.41 180 top
C5  27.94,105.41 180 top
C8  31.75,82.55 90 top
C9  39.37,34.29 90 top
C10  39.37,27.94 270 top
C11  59.69,5.08 0 top
DC_5V  31.75,110.49 0 top
DC_+/-15V  55.88,34.29 90 top
FRAME1  22.61,-11.94 0 top  (outside the outline)
FRAME2  22.61,-11.81 0 top  (outside the outline)
GND  262.25,10.92 0 top
GND@  33.91,133.1 0 top
IC1  91.44,118.11 270 top
IC3  91.44,85.09 270 top
IC4  91.44,52.07 270 top
IC5  91.44,19.05 270 top
IC6  187.96,118.11 270 top
IC8  187.96,85.09 270 top
IC10  187.96,52.07 270 top
J1  226.06,13.97 0 top
J2  238.76,13.97 0 top
JP1  6.35,69.85 90 top
JP2  6.35,81.28 90 top
JP3  6.35,58.42 90 top
JP4  5.08,24.13 90 top
JP5  5.08,41.91 90 top
JP6  5.08,6.35 90 top
R_A  24.13,72.39 180 top
R_B  24.13,57.15 0 top
R_T  24.13,64.77 0 top
SL1  209.55,63.5 0 top
U$1  10.16,101.6 90 top
U$2  55.88,111.76 0 top
U$3  24.13,83.82 180 top
U$4  33.02,0 180 top
U$5  [RIC_LOGO_BIG]  200.66,8.89 0 top
U$6  10.16,128.27 90 top
U$7  139.7,96.52 0 top
U$8  139.7,129.54 0 top
U$9  139.7,63.5 0 top
U$10  [STAND-OFF]  19.05,6.35 0 top
U$11  [STAND-OFF]  19.05,133.35 0 top
U$12  [STAND-OFF]  273.05,133.35 0 top
U$13  [STAND-OFF]  273.05,6.35 0 top
U$14  139.7,30.48 0 top
U$15  236.22,129.54 0 top
U$17  236.22,96.52 0 top

### Tracks (layer width: path | path; a pad name or v marks a point on that pad's centre or on a via)
3.3V
  Top 0.61: R_A.P$1 27.94,74.93 U$3.8 30.61,80.01 C8.1 36.7,81.15 | 36.7,81.15 U$2.3.3V3 | 3.3V.1 36.7,73.03 36.7,81.15
+5V
  Top 0.61: U$2.VIN 60.96,130.81 46.99,130.81 39.37,123.19 39.37,106.68 38.1,105.41 C4.1 36.96,107.82 DC_5V.3 29.08,115.7 5V.1
+12V  (via drill 0.51)
  Top 0.61: U$8.24 168.91,130.81 167.64,132.08 161.29,132.08 | 161.29,132.08 153.67,132.08 | 153.67,132.08 146.05,132.08 | 146.05,132.08 138.43,132.08 | 138.43,132.08 130.81,132.08 | 130.81,132.08 123.19,132.08 | 123.19,132.08 116.84,132.08 115.57,130.81 U$8.3 | 123.19,132.08 U$8.6 | 130.81,132.08 U$8.9 | 138.43,132.08 U$8.12 | U$8.15 146.05,132.08 | U$8.18 153.67,132.08 | U$8.21 161.29,132.08 | U$15.3 212.09,130.81 213.36,132.08 219.71,132.08 | 219.71,132.08 227.33,132.08 | 227.33,132.08 234.95,132.08 | 234.95,132.08 242.57,132.08 | 242.57,132.08 250.19,132.08 | 250.19,132.08 257.81,132.08 | 257.81,132.08 264.16,132.08 | U$15.21 257.81,132.08 | U$15.18 250.19,132.08 | U$15.15 242.57,132.08 | U$15.12 234.95,132.08 | U$15.9 227.33,132.08 | U$15.6 219.71,132.08 | U$17.3 212.09,97.79 213.36,99.06 | 264.16,99.06 265.43,97.79 U$17.24 | U$17.21 257.81,99.06 | U$17.18 250.19,99.06 | U$17.15 242.57,99.06 | U$17.12 234.95,99.06 | U$17.9 227.33,99.06 | U$17.6 219.71,99.06 | SL1.2 212.09,64.77 213.36,66.04 | 226.06,66.04 227.33,64.77 SL1.8 | SL1.5 219.71,66.04 | U$9.3 115.57,64.77 116.84,66.04 123.19,66.04 | 123.19,66.04 130.81,66.04 | 130.81,66.04 138.43,66.04 | 138.43,66.04 146.05,66.04 | 146.05,66.04 153.67,66.04 U$9.18 | 167.64,66.04 168.91,64.77 U$9.24 168.91,62.23 151.13,44.45 97.79,44.45 IC4.10 | U$9.21 161.29,66.04 | U$9.15 146.05,66.04 | U$9.12 138.43,66.04 | U$9.9 130.81,66.04 | U$9.6 123.19,66.04 | U$7.3 115.57,97.79 116.84,99.06 123.19,99.06 | 123.19,99.06 130.81,99.06 | 130.81,99.06 138.43,99.06 | 138.43,99.06 146.05,99.06 U$7.15 | 167.64,99.06 168.91,97.79 U$7.24 168.91,93.98 152.4,77.47 97.79,77.47 IC3.10 | U$7.21 161.29,99.06 | U$7.18 153.67,99.06
  Top 0.61: U$7.12 138.43,99.06 | U$7.9 130.81,99.06 | U$7.6 123.19,99.06 | U$14.3 115.57,31.75 116.84,33.02 123.19,33.02 | 123.19,33.02 130.81,33.02 | 130.81,33.02 138.43,33.02 | 138.43,33.02 146.05,33.02 | 146.05,33.02 153.67,33.02 | 153.67,33.02 161.29,33.02 | 161.29,33.02 167.64,33.02 168.91,31.75 U$14.24 168.91,5.08 | U$14.21 161.29,33.02 | U$14.18 153.67,33.02 | U$14.15 146.05,33.02 | U$14.12 138.43,33.02 | U$14.9 130.81,33.02 | U$14.6 123.19,33.02 | DC_5V.1 29.34,110.36 C5.1 | J1.1 226.06,5.08 | J2.1 241.94,10.79 | IC1.10 93.98,107.95 | IC5.10 95.25,5.08 | +12V.1 36.58,10.41 36.83,10.16
  Top 1.016: 153.67,66.04 161.29,66.04 167.64,66.04 191.77,66.04 | 146.05,99.06 153.67,99.06 161.29,99.06 167.64,99.06 191.77,99.06 | C9.1 C10.1 48.26,20.45 48.26,15.24 | 191.77,99.06 213.36,99.06 219.71,99.06 227.33,99.06 234.95,99.06 242.57,99.06 250.19,99.06 257.81,99.06 264.16,99.06 273.05,99.06 273.05,121.92 U$15.24 265.43,130.81 264.16,132.08 116.84,132.08 v92.71,132.08 92.71,109.22 93.98,107.95 | 191.77,66.04 213.36,66.04 219.71,66.04 226.06,66.04 273.05,66.04 | IC8.10 191.77,66.04 | IC6.10 191.77,99.06
  Top 1.27: U$4.TIP 33.79,10.16 36.83,10.16 46.99,10.16 DC_+/-15V.3 | C1.1 53.34,5.08 | 53.34,5.08 C11.1 57.74,5.67 DC_+/-15V.1 | DC_+/-15V.3 48.26,15.24 74.93,15.24 85.09,5.08 95.25,5.08 168.91,5.08 191.77,5.08 | 191.77,5.08 226.06,5.08 236.22,5.08 241.94,10.79 273.05,41.91 273.05,66.04 273.05,99.06 | IC10.10 191.77,5.08 | DC_+/-15V.3 53.34,6.35 53.34,5.08
  Bottom 1.016: DC_5V.1 29.21,123.19 38.26,132.24 92.55,132.24 v92.71,132.08
+15V
  Top 1.016: DC_+/-15V.4 56.52,47.62 | 56.52,47.62 55.24,46.35 | 55.24,46.35 44.58,35.69 C9.2 27.81,24.13 8.89,24.13 | 8.89,24.13 JP4.1 | JP5.1 8.89,38.1 8.89,24.13 | JP6.1 8.89,10.16 8.89,24.13 | 55.24,46.35 | 56.52,47.62
-15V
  Bottom 1.016: JP5.3 8.89,45.1 | JP6.3 8.89,17.16 8.89,30.48 | 8.89,45.1 8.89,30.48 | DC_+/-15V.6 35.56,46.99 10.78,46.99 8.89,45.1 | JP4.3 8.24,31.13 8.89,30.48
A
  Top 0.203: JP2.1 8.89,78.74 8.89,72.39 | 8.89,72.39 JP1.1 | R_T.P$1 R_A.P$2 | U$3.6 22.86,77.47 R_A.P$2 | R_A.P$2 8.89,72.39
  Bottom 0.203: JP1.1 5.08,68.58 5.08,59.69 JP3.1
B
  Top 0.203: JP2.2 5.08,82.55 5.08,72.39 | 5.08,72.39 5.08,62.23 JP3.2 10.16,57.15 R_B.P$1 22.86,57.15 R_T.P$2 25.4,69.85 U$3.7 | JP1.2 5.08,72.39
BNC1  (via drill 0.36)
  Top 0.203: v66.65,121.31 66.65,126.69 61.87,131.47 46.63,131.47 43.48,128.32 10.16,128.32 U$6.S
  Bottom 0.203: v66.65,121.31 66.65,111.15 63.5,108 U$2.18/A4
BNC2
  Top 0.203: U$1.S 10.16,100.99 19.2,91.95 19.2,87.17 19.91,86.46 30.38,86.46 48.26,104.34 49.07,104.34 54.15,109.42 62.48,109.42 63.5,110.44 U$2.19/A5
GND  (via drill 0.51, 0.76)  (1 unrouted)
  other vias: 82.55,60.96 55.88,64.14
  pour Bottom: 0,137.16 279.4,137.16 279.4,0 0,0
  pour Top (rank 2): 0,137.16 279.4,137.16 279.4,0 0,0
N$2
  Top 0.61: IC1.18 111.76,128.27 U$8.2
N$3
  Top 0.61: U$8.5 120.65,128.27 118.11,125.73 IC1.17
N$4
  Top 0.61: U$8.8 128.27,128.27 123.19,123.19 IC1.16
N$5
  Top 0.61: U$8.11 135.89,128.27 128.27,120.65 IC1.15
N$6
  Top 0.61: U$8.14 143.51,128.27 133.35,118.11 IC1.14
N$7
  Top 0.61: U$8.17 151.13,128.27 138.43,115.57 IC1.13
N$8
  Top 0.61: U$8.20 158.75,128.27 143.51,113.03 IC1.12
N$9
  Top 0.61: U$8.23 166.37,128.27 148.59,110.49 IC1.11
N$17
  Top 0.61: U$7.23 166.37,95.25 149.86,78.74 96.52,78.74 IC3.11
N$18
  Top 0.61: U$7.20 158.75,95.25 143.51,80.01 IC3.12
N$19
  Top 0.61: U$7.17 151.13,95.25 138.43,82.55 IC3.13
N$20
  Top 0.61: U$7.14 143.51,95.25 133.35,85.09 IC3.14
N$21
  Top 0.61: U$7.11 135.89,95.25 128.27,87.63 IC3.15
N$22
  Top 0.61: U$7.8 128.27,95.25 123.19,90.17 IC3.16
N$23
  Top 0.61: U$7.5 120.65,95.25 118.11,92.71 IC3.17
N$24
  Top 0.61: IC3.18 111.76,95.25 U$7.2
N$25
  Top 0.61: U$9.23 166.37,62.23 149.86,45.72 96.52,45.72 IC4.11
N$26
  Top 0.61: U$9.20 158.75,62.23 143.51,46.99 IC4.12
N$27
  Top 0.61: U$9.17 151.13,62.23 138.43,49.53 IC4.13
N$28
  Top 0.61: U$9.14 143.51,62.23 133.35,52.07 IC4.14
N$29
  Top 0.61: U$9.11 135.89,62.23 128.27,54.61 IC4.15
N$30
  Top 0.61: U$9.8 128.27,62.23 123.19,57.15 IC4.16
N$31
  Top 0.61: U$9.5 120.65,62.23 118.11,59.69 IC4.17
N$32
  Top 0.61: IC4.18 111.76,62.23 U$9.2
N$33
  Top 0.61: U$14.23 166.37,29.21 148.59,11.43 IC5.11
N$34
  Top 0.61: U$14.20 158.75,29.21 143.51,13.97 IC5.12
N$35
  Top 0.61: U$14.17 151.13,29.21 138.43,16.51 IC5.13
N$36
  Top 0.61: U$14.14 143.51,29.21 133.35,19.05 IC5.14
N$37
  Top 0.61: U$14.11 135.89,29.21 128.27,21.59 IC5.15
N$38
  Top 0.61: U$14.8 128.27,29.21 123.19,24.13 IC5.16
N$39
  Top 0.61: U$14.5 120.65,29.21 118.11,26.67 IC5.17
N$40
  Top 0.61: IC5.18 111.76,29.21 U$14.2
N$51
  Top 0.61: U$15.23 262.89,128.27 245.11,110.49 IC6.11
N$52
  Top 0.61: U$15.20 255.27,128.27 240.03,113.03 IC6.12
N$61
  Top 0.61: U$15.17 247.65,128.27 234.95,115.57 IC6.13
N$63
  Top 0.61: U$15.14 240.03,128.27 229.87,118.11 IC6.14
N$64
  Top 0.61: U$15.11 232.41,128.27 224.79,120.65 IC6.15
N$65
  Top 0.61: U$15.8 224.79,128.27 219.71,123.19 IC6.16
N$66
  Top 0.61: U$15.5 217.17,128.27 214.63,125.73 IC6.17
N$67
  Top 0.61: IC6.18 208.28,128.27 U$15.2
N$76
  Top 0.61: U$17.23 262.89,95.25 245.11,77.47 IC8.11
N$77
  Top 0.61: U$17.20 255.27,95.25 240.03,80.01 IC8.12
N$78
  Top 0.61: U$17.17 247.65,95.25 234.95,82.55 IC8.13
N$79
  Top 0.61: U$17.14 240.03,95.25 229.87,85.09 IC8.14
N$80
  Top 0.61: U$17.11 232.41,95.25 224.79,87.63 IC8.15
N$81
  Top 0.61: U$17.8 224.79,95.25 219.71,90.17 IC8.16
N$82
  Top 0.61: U$17.5 217.17,95.25 214.63,92.71 IC8.17
N$83
  Top 0.61: IC8.18 208.28,95.25 U$17.2
N$92
  Top 0.61: J2.2 241.3,17.78 214.63,44.45 IC10.11
N$93
  Bottom 0.61: J1.2 228.6,20.32 201.93,46.99 IC10.12
N$97
  Top 0.61: IC10.16 219.71,57.15 224.79,62.23 SL1.7
N$98
  Top 0.61: IC10.17 214.63,59.69 217.17,62.23 SL1.4
N$99
  Top 0.61: IC10.18 208.28,62.23 SL1.1
RTS
  Top 0.203: U$3.2 U$3.3
  Bottom 0.203: U$2.28 48.26,80.06 32.92,80.06 25.4,87.58 U$3.2
RX
  Bottom 0.203: U$2.0 48.26,125.68 48.26,124.66 35.56,111.96 35.56,95.3 27.94,87.68 U$3.1
TX
  Top 0.203: U$2.1 48.26,123.14 48.26,122.12 40.03,113.89 40.03,106.27 22.55,88.8 21.44,88.8 20.32,87.68 U$3.4
V01
  Bottom 0.203: IC1.1 87.58,128.22 67.46,128.22 63.6,124.36 51.92,124.36 48.26,120.7 U$2.2
V02
  Bottom 0.203: IC1.2 87.58,125.68 67.56,125.68 63.6,121.72 52.73,121.72 51.51,120.5 50.6,120.5 48.26,118.16 U$2.3
V03
  Bottom 0.203: IC1.3 87.58,123.14 67.46,123.14 63.5,119.18 55.27,119.18 51.71,115.62 48.26,115.62 U$2.4
V04
  Top 0.203: IC1.4 87.58,120.6 64.92,120.6 63.5,119.18 55.27,119.18 51.51,115.42 50.6,115.42 48.26,113.08 U$2.5
V05
  Top 0.203: IC1.5 87.58,118.06 64.92,118.06 63.5,116.64 57.81,116.64 51.71,110.54 48.26,110.54 U$2.6
V06
  Top 0.203: IC1.6 87.58,115.52 64.92,115.52 63.5,114.1 60.96,114.1 58.83,111.96 53.75,111.96 49.78,108 48.26,108 U$2.7
V07
  Top 0.203: IC1.7 87.58,112.98 64.92,112.98 63.5,111.56 54.36,111.56 48.26,105.46 U$2.8
V08
  Top 0.203: IC1.8 87.58,110.44 64.92,110.44 63.5,109.02 54.36,109.02 48.26,102.92 U$2.9
V09
  Top 0.203: IC3.1 87.58,95.3 73.15,95.3 66.85,101.6 49.48,101.6 48.26,100.38 U$2.10
V10
  Bottom 0.203: IC3.2 87.58,92.76 73.66,92.76 65.02,101.4 59.44,101.4 55.88,97.84 48.26,97.84 U$2.11
V11
  Top 0.203: IC3.3 87.68,90.12 87.68,89.51 89.2,87.99 89.2,87.27 88.59,86.67 84.53,86.67 80.26,90.93 74.88,90.93 72.34,93.47 64.21,93.47 63.91,93.78 50.39,93.78 48.97,95.2 48.26,95.2 U$2.12
V12
  Top 0.203: IC3.4 87.58,87.68 84.12,87.68 80.47,91.34 75.08,91.34 71.22,95.2 63.5,95.2 U$2.13
V13
  Bottom 0.203: IC3.5 87.58,85.14 76.1,85.14 63.5,97.74 U$2.14/A0
V14  (via drill 0.36)
  Top 0.203: v79.96,90.22 87.58,82.6 IC3.6 | v64.72,99.06 63.5,100.28 U$2.15/A1
  Bottom 0.203: v79.96,90.22 73.56,90.22 v64.72,99.06
V15
  Top 0.203: IC3.7 87.68,80.06 90.02,82.4 90.02,94.79 81.99,102.82 63.5,102.82 U$2.16/A2
V16  (via drill 0.36)
  Top 0.203: v57.3,100.89 61.47,96.72 70.31,96.72 75.29,91.75 87.99,91.75 89.61,90.12 89.61,82.6 88.59,81.58 87.27,81.58 86.06,80.37 86.06,79.65 87.58,78.13 87.58,77.52 IC3.8
  Bottom 0.203: v57.3,100.89 57.71,100.89 62.18,105.36 63.5,105.36 U$2.17/A3
V17
  Top 0.203: IC4.1 87.68,62.28 87.68,73.05 90.42,75.79 90.42,112.17 88.59,114 64.41,114 63.5,113.08 U$2.20/A6
V18  (via drill 0.36)
  Top 0.203: v78.74,86.97 84.33,81.38 84.33,63.6 87.58,60.35 87.58,59.74 IC4.2 | v68.07,94.18 62.59,94.18 v56.59,100.18
  Bottom 0.203: v78.74,86.97 75.29,86.97 v68.07,94.18 | v56.59,100.18 56.59,104.65 57.3,105.36 57.3,110.85 58.42,111.96 59.94,111.96 63.5,115.52 U$2.21/A7
V19
  Top 0.203: IC4.3 87.68,57.2 87.68,57.81 91.64,61.77 91.64,116.03 88.59,119.08 64.41,119.08 63.5,118.16 U$2.22/A8
V20  (via drill 0.36)
  Top 0.203: v78.33,54.66 77.93,54.66 63.8,68.78 63.09,68.78 59.54,72.34 59.54,72.75 58.42,73.86 58.01,73.86 57,74.88 57,75.29 55.88,76.4 v54.46,76.4
  Bottom 0.203: v78.33,54.66 87.58,54.66 IC4.4 | v54.46,76.4 54.46,76.81 49.38,81.89 49.38,82.91 48.26,84.02 47.85,84.02 46.74,85.14 46.74,115.52 48.26,117.04 50.09,117.04 51.31,118.26 53.75,118.26 55.07,119.58 62.48,119.58 63.5,120.6 U$2.23/A9
V21
  Top 0.203: IC4.5 87.58,52.12 85.24,52.12 63.5,73.86 63.09,73.86 59.94,77.01 59.94,79.96 58.42,81.48 58.01,81.48 57,82.5 57,82.91 55.88,84.02 54.36,84.02 48.26,90.12 U$2.24
V22
  Top 0.203: IC4.6 87.58,49.58 85.24,49.58 63.5,71.32 63.09,71.32 59.54,74.88 59.54,77.83 58.42,78.94 58.01,78.94 57,79.96 57,80.37 55.88,81.48 55.47,81.48 54.46,82.5 54.46,83.01 49.89,87.58 48.26,87.58 U$2.25
V23
  Top 0.203: IC4.7 87.58,47.04 84.94,47.04 63.6,68.38 61.47,68.38 58.52,71.32 55.47,71.32 50.19,76.61 50.19,81.69 49.38,82.5 49.38,83.92 48.26,85.04 U$2.26
V24
  Top 0.203: IC4.8 87.58,44.5 86.87,44.5 67.06,64.31 59.94,64.31 49.78,74.47 49.78,80.97 48.26,82.5 U$2.27
V25
  Top 0.203: IC5.1 87.58,29.26 87.58,40.03 69.09,58.52 69.09,61.67 68.28,62.48 61.16,62.48 49.38,74.27 49.38,76.3 48.26,77.42 U$2.29
V26
  Top 0.203: IC5.2 87.58,26.72 87.58,27.33 68.68,46.23 68.68,61.47 68.07,62.08 60.96,62.08 48.26,74.78 48.26,74.88 U$2.30
V27  (via drill 0.36)
  Top 0.203: v62.08,54.76 61.87,54.76 47.14,69.49 47.14,71.22 48.26,72.34 U$2.31/A12
  Bottom 0.203: v62.08,54.76 62.08,50.29 87.58,24.79 87.58,24.18 IC5.3
V28
  Top 0.203: IC5.4 87.58,21.64 87.58,22.25 68.28,41.55 68.28,61.27 67.87,61.67 56.39,61.67 48.26,69.8 U$2.32/A13
V29
  Bottom 0.203: IC5.5 87.58,19.1 87.58,19.71 61.37,45.92 61.37,67.67 63.5,69.8 U$2.33/A14
V30
  Bottom 0.203: IC5.6 87.58,16.56 87.58,17.17 60.96,43.79 60.96,69.8 63.5,72.34 U$2.34/A15
V31  (via drill 0.36)
  Top 0.203: v67.56,60.96 67.56,34.65 87.58,14.63 87.58,14.02 IC5.7
  Bottom 0.203: v67.56,60.96 67.56,70.81 63.5,74.88 U$2.35/A16
V32
  Bottom 0.203: IC5.8 87.58,11.48 87.58,12.09 60.55,39.12 60.55,74.47 63.5,77.42 U$2.36/A17
V33  (via drill 0.36)
  Top 0.203: v93.07,91.14 93.07,95.2 98.45,100.58 140.82,100.58 159.31,119.08 184.51,119.08 185.72,120.29 185.72,126.09 184.2,127.61 184.2,128.22 IC6.1 | v76,86.26 75.69,86.26 70.81,81.38 67.16,81.38 63.5,85.04 U$2.39/A20
  Bottom 0.203: v93.07,91.14 88.19,86.26 v76,86.26
V34  (via drill 0.36)
  Top 0.203: v92.35,92.96 92.35,96.52 97.23,101.4 140.41,101.4 164.69,125.68 184.1,125.68 IC6.2 | v79.35,88.59 71.73,80.97 66.55,80.97 63.5,84.02 63.09,84.02 59.54,87.58 59.54,87.99 58.42,89.1 56.9,89.1 55.88,90.12 U$2.40
  Bottom 0.203: v92.35,92.96 87.99,88.59 v79.35,88.59
V35  (via drill 0.36)
  Top 0.203: v67.06,105.97 65.02,103.94 50.8,103.94 48.26,101.4 47.85,101.4 47.14,100.69 47.14,94.89 48.16,93.88 49.68,93.88 55.88,87.68 U$2.41
  Bottom 0.203: v67.06,105.97 95.3,105.97 112.47,123.14 184.1,123.14 IC6.3
V36  (via drill 0.36)
  Top 0.203: v94.08,97.23 97.84,100.99 140.61,100.99 160.22,120.6 184.1,120.6 IC6.4
  Bottom 0.203: v94.08,97.23 88.59,91.75 74.07,91.75 66.04,99.77 64.41,99.77 63.5,98.86 63.09,98.86 59.54,95.3 59.54,87.27 58.42,86.16 56.9,86.16 55.88,85.14 U$2.42
V37  (via drill 0.36)
  Top 0.203: v98.65,98.75 99.67,99.77 141.22,99.77 150.77,109.32 184.91,109.32 185.72,110.13 185.72,115.93 184.2,117.45 184.2,118.06 IC6.5 | v68.68,98.75 65.43,98.75 65.02,98.35 64.41,98.35 63.91,98.86 v62.08,98.86
  Bottom 0.203: v68.68,98.75 v98.65,98.75 | v62.08,98.86 62.08,98.45 54.36,90.73 54.36,83.11 54.76,82.7 54.76,81.18 55.88,80.06 U$2.43
V38  (via drill 0.36)
  Top 0.203: v150.77,89.31 146.1,89.31 138.38,81.58 v92.35,81.58
  Bottom 0.203: v150.77,89.31 157.48,96.01 157.48,97.03 175.97,115.52 184.1,115.52 IC6.6 | v92.35,81.58 72.03,81.58 70.81,82.8 65.23,82.8 63.5,81.08 60.96,81.08 58.42,78.54 56.9,78.54 55.88,77.52 U$2.44
V39
  Bottom 0.203: IC6.7 184.2,113.08 184.2,113.69 185.72,115.21 185.72,123.55 184.51,124.77 93.07,124.77 88.59,129.24 66.04,129.24 63.6,126.8 53.34,126.8 48.26,121.72 47.85,121.72 46.33,120.19 46.33,83.01 48.26,81.08 48.77,81.08 54.86,74.98 55.88,74.98 U$2.45
V40  (via drill 0.36)
  Top 0.203: v95.4,96.52 99.06,100.18 141.02,100.18 151.28,110.44 184.1,110.44 IC6.8 | v73.46,91.34 55.58,91.34 54.76,90.53 54.76,89.81 55.88,88.7 56.29,88.7 57,87.99 57,87.27 56.29,86.56 53.34,86.56 48.67,91.24 47.85,91.24 47.14,90.53 47.14,87.27 48.26,86.16 48.67,86.16 52.22,82.6 52.22,76.1 55.88,72.44 U$2.46
  Bottom 0.203: v95.4,96.52 93.98,96.52 88.8,91.34 v73.46,91.34
V41
  Bottom 0.203: IC8.1 184.1,95.2 173.74,95.2 166.01,87.48 110.95,87.48 96.62,101.8 59.23,101.8 56.29,98.86 47.85,98.86 47.14,98.15 47.14,87.27 48.26,86.16 48.67,86.16 52.22,82.6 52.22,79.65 55.88,76 56.29,76 57.3,74.98 57.3,73.56 58.42,72.44 U$2.47
V42  (via drill 0.36)
  Top 0.203: v98.25,76.5 152.4,76.5 168.55,92.66 184.1,92.66 IC8.2
  Bottom 0.203: v98.25,76.5 65.94,76.5 63.91,78.54 61.98,78.54 58.42,74.98 U$2.48
V43
  Bottom 0.203: IC8.3 184.2,90.12 184.2,89.51 185.72,87.99 185.72,79.65 185.01,78.94 59.84,78.94 58.42,77.52 U$2.49
V44  (via drill 0.36)
  Top 0.203: v59.84,81.08 63.91,81.08 83.52,61.47 83.52,59.33 86.67,56.19 88.59,56.19 89.2,56.79 89.2,58.12 97.84,66.75 143.26,66.75 164.08,87.58 184.1,87.58 IC8.4
  Bottom 0.203: v59.84,81.08 59.44,81.08 58.42,80.06 U$2.50
V45
  Bottom 0.203: IC8.5 184.1,85.04 97.13,85.04 96.11,84.02 59.44,84.02 58.42,85.04 U$2.51
V46
  Bottom 0.203: IC8.6 184.1,82.6 97.13,82.6 96.11,83.62 55.88,83.62 54.76,84.73 54.76,85.45 55.88,86.56 57.4,86.56 58.42,87.58 U$2.52
V47  (via drill 0.36)
  Top 0.203: v70.51,82.09 63.5,89.1 59.44,89.1 58.42,90.12 U$2.53
  Bottom 0.203: v70.51,82.09 71.42,81.18 88.39,81.18 88.7,80.87 92.66,80.87 92.76,80.97 96.22,80.97 97.13,80.06 184.1,80.06 IC8.7
V48  (via drill 0.36)
  Top 0.203: v165.51,88.59 185.12,88.59 185.72,87.99 185.72,79.65 184.2,78.13 184.2,77.52 IC8.8 | v65.33,105.26 64.82,105.26 63.91,104.34 59.44,104.34 58.42,105.36 U$2.54
  Bottom 0.203: v165.51,88.59 111.05,88.59 94.39,105.26 v65.33,105.26
V49  (via drill 0.36)
  Top 0.203: v87.78,98.04 87.38,98.04 78.54,106.88 59.44,106.88 58.42,107.9 U$2.55
  Bottom 0.203: v87.78,98.04 94.89,98.04 105.87,87.07 166.22,87.07 170.28,91.14 185.12,91.14 186.13,90.12 186.13,74.98 184.2,73.05 184.2,62.28 IC10.1
V50
  Bottom 0.203: IC10.2 184.2,59.74 184.2,60.35 186.54,62.69 186.54,94.79 185.12,96.22 174.14,96.22 165.81,87.88 111.15,87.88 94.49,104.55 65.02,104.55 64.62,104.95 64.62,105.77 63.5,106.88 61.98,106.88 58.42,110.44 U$2.56
V51  (via drill 0.36)
  Top 0.203: v90.93,75.29 90.93,112.27 88.59,114.61 65.94,114.61 v65.73,114.81
  Bottom 0.203: v90.93,75.29 109.02,57.2 184.1,57.2 IC10.3 | v65.73,114.81 63.91,116.64 63.09,116.64 62.08,115.62 62.08,115.21 59.94,113.08 58.42,113.08 U$2.57
V-3WAY-1
  Top 0.203: IC10.7 184.1,46.94 154.63,46.94 150.98,43.28 98.65,43.28 96.32,40.95 94.18,40.95 89.2,45.92 89.2,52.43 87.99,53.65 86.67,53.65 64.62,75.69 64.62,78.84 63.5,79.96 U$2.37/A18
V-3WAY-2  (via drill 0.36)
  Top 0.203: v83.62,75.79 70.21,75.79 63.5,82.5 U$2.38/A19
  Bottom 0.203: v83.62,75.79 114.91,44.5 184.1,44.5 IC10.8

### Text on the board
tPlace: BNC 1 | BNC 2 | Teensy 3.5 | G | B | (Cut trace between V_IN and V_USB.) | A | G | B | A | G | B | A | - | C | + | +/-15V | - | C | + | - | C | +
tNames: 1 | 8 | 33 | 40 | VX7805-500 | 9 | 16 | 41 | 48 | MFC Comm | MFC Power | 17 | 24 | 49 | 51 | JTL6024D15 | ODB | 25 | 32 | The Olfactory Delivery Board v2.1 / October 2018, OM / HMS Research Instrumentation Core | AV1 | AV2 | Aux Valves